# Altium schematic sheet [12]_MOT_tCONNECTOR.SchDoc
size A3; DocumentNumber: 12; SheetNumber: 12; SheetTotal: 12; Ngu?i ki?m tra: bangdd; Ngu?i thi?t k?: thannt114
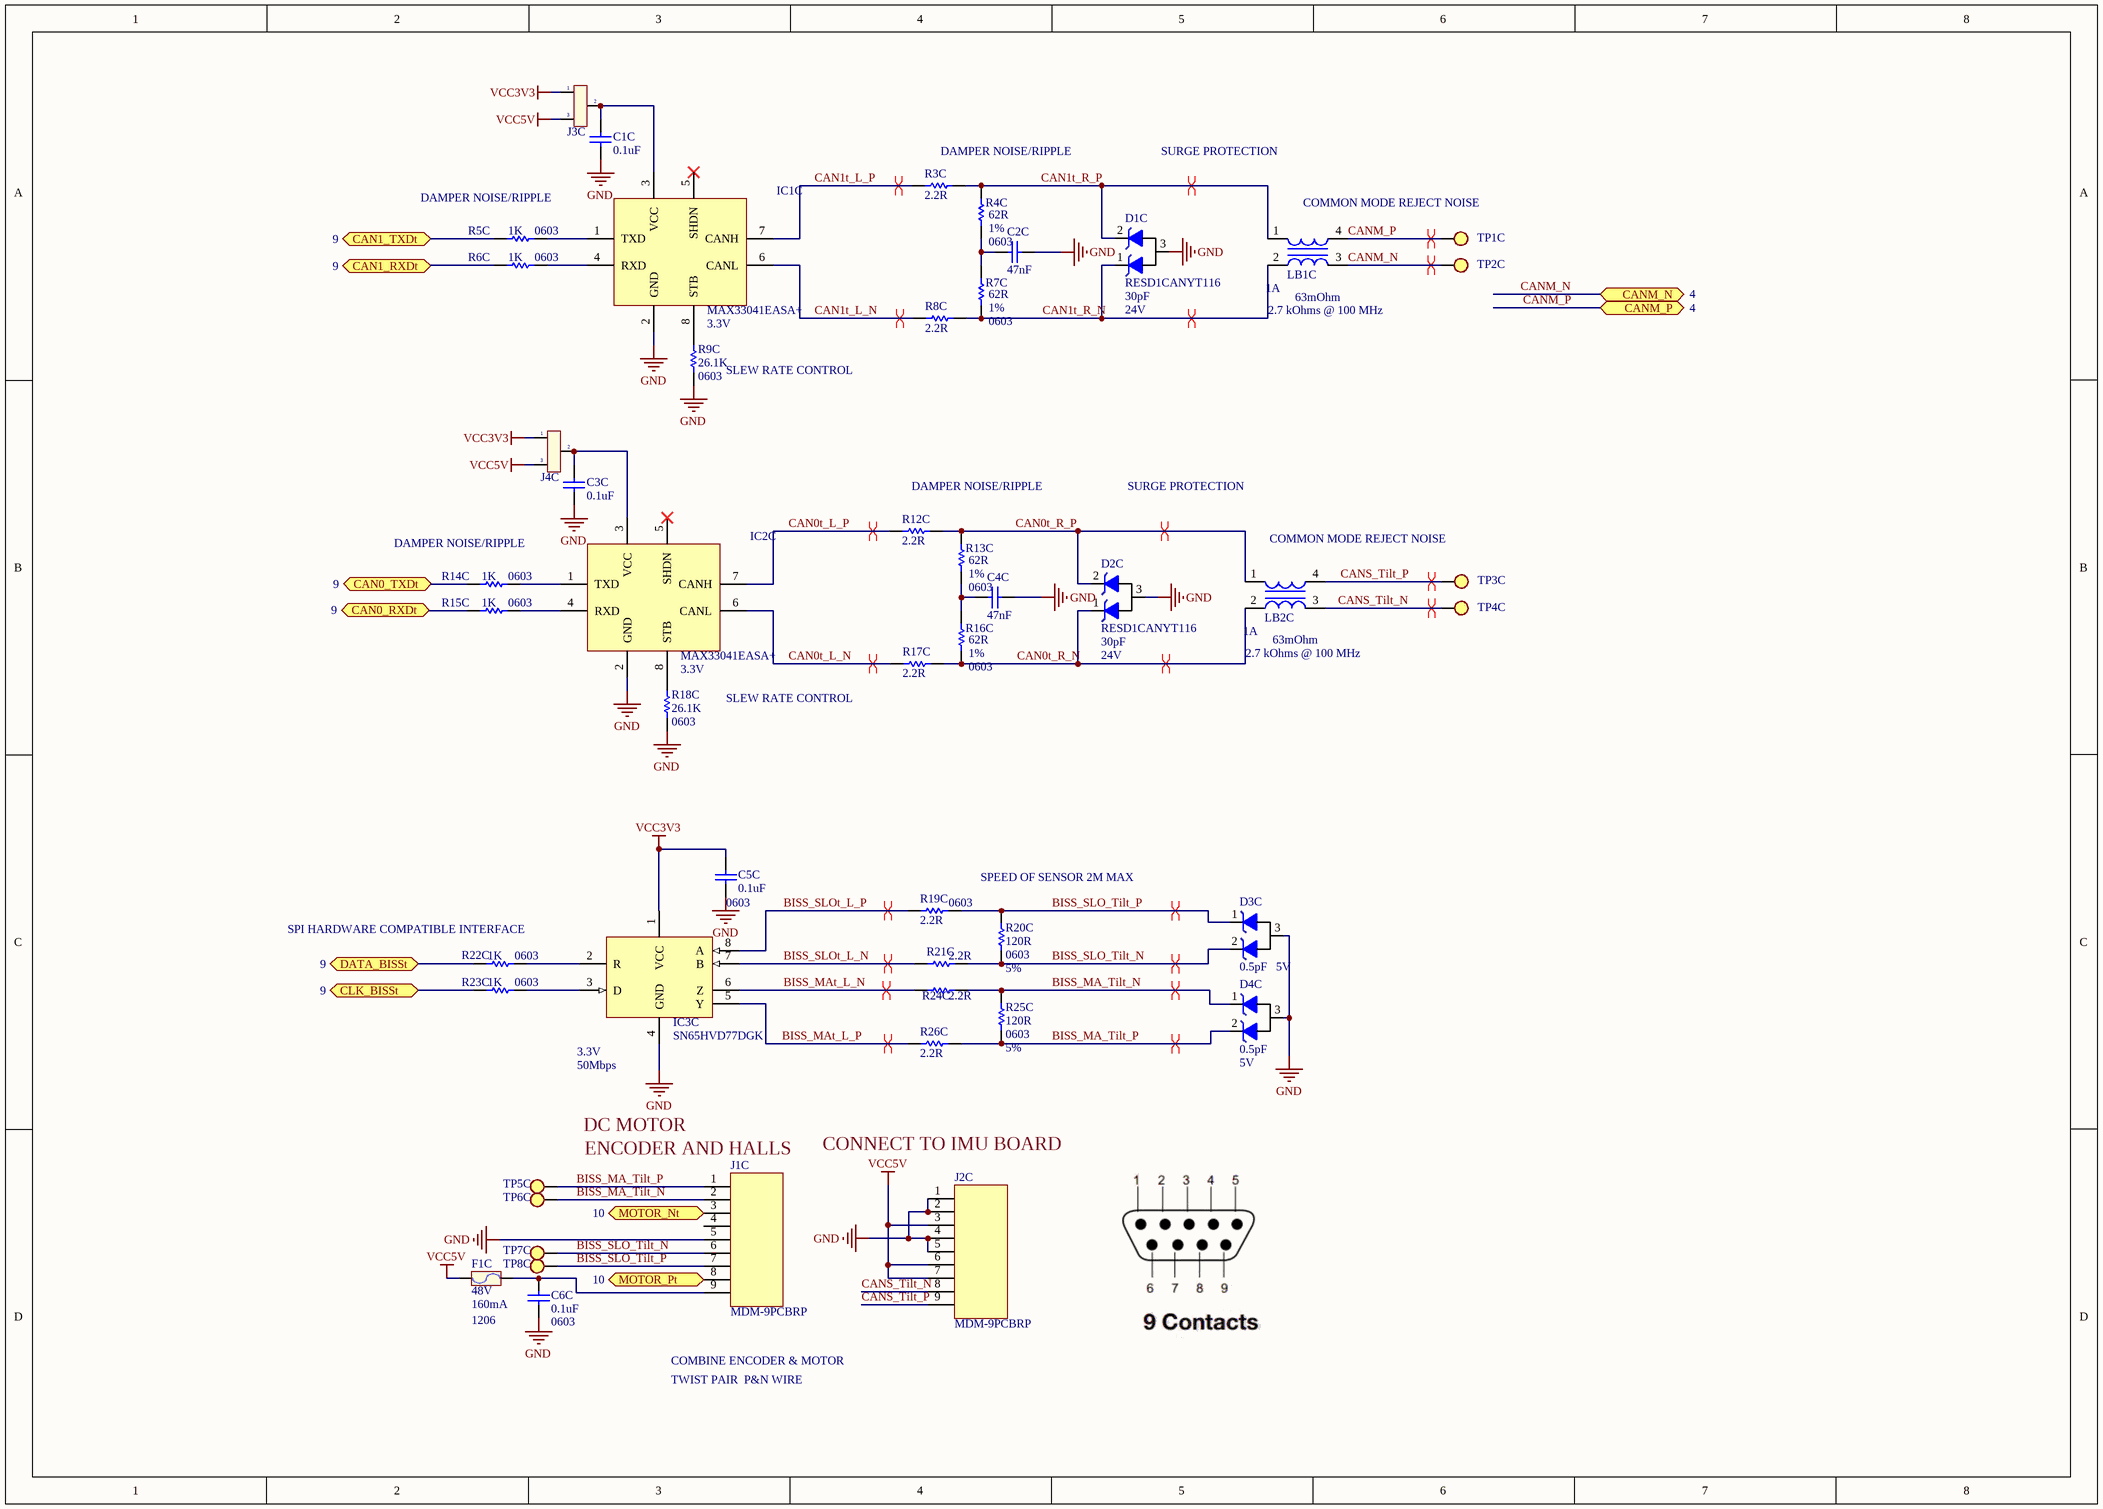
[diagram p0: [12]_MOT_tCONNECTOR.SchDoc]

## Parts
C1C  0.1uF  [CAP 0603]
C2C  47nF  [CAP 0603]
C3C  0.1uF  [CAP 0603]
C4C  47nF  [CAP 0603]
C5C  FOOTPRINT: 0603  [CAP 0603]  (hidden comment: 0.1uF)
C6C  FOOTPRINT: 0603  [CAP 0603]  (hidden comment: 0.1uF)
D1C  CAPACITANCE: 30pF  VOLTAGE: 24V  [SOT-23-3]  (hidden comment: RESD1CANYT116)
D2C  CAPACITANCE: 30pF  VOLTAGE: 24V  [SOT-23-3]  (hidden comment: RESD1CANYT116)
D3C  CAPACITANCE: 0.5pF  VOLTAGE: 5V  [SOT-416]  (hidden comment: ESDR0502BT1G)
D4C  CAPACITANCE: 0.5pF  VOLTAGE: 5V  [SOT-416]  (hidden comment: ESDR0502BT1G)
F1C  Voltage - Rated: 48V  Package / Case: 1206  Current Rating (Amps): 160mA  [RES 1206]  (hidden comment: 0ZCG0014FF2C)
IC1C  VOLTAGE: 3.3V  [8-SOIC]  (hidden comment: MAX33041EASA+)
IC2C  VOLTAGE: 3.3V  [8-SOIC]  (hidden comment: MAX33041EASA+)
IC3C  Manufacturer Part Number: SN65HVD77DGK  VOLTAGE: 3.3V  SPEED: 50Mbps  [8-VSSOP]  (hidden comment: IC;IC TRANSCEIVER FULL 1/1 8SOIC,8-SOIC,-40TO 85°C,SN65HVD77DR)
J1C  CONN-DIP;CONN MICRO-D PLUG 9POS R/A SLDR,M,MDM-9PCBRP  [MDM-9PCBRP]  (value not drawn)
J2C  CONN-DIP;CONN MICRO-D PLUG 9POS R/A SLDR,M,MDM-9PCBRP  [MDM-9PCBRP]  (value not drawn)
J3C  JP 2-1  [JP3]  (value not drawn)
J4C  JP 2-1  [JP3]  (value not drawn)
LB1C  CURRENT: 1A  IMPEDANCE: 2.7 kOhms @ 100 MHz  DCR: 63mOhm  [MCM-7060M]  (hidden comment: MCM-7060M-272-RU)
LB2C  CURRENT: 1A  IMPEDANCE: 2.7 kOhms @ 100 MHz  DCR: 63mOhm  [MCM-7060M]  (hidden comment: MCM-7060M-272-RU)
R3C  2.2R  [res 0603]
R4C  TOLERANCE: 1%  PACKAGE: 0603  [R0603]  (hidden comment: 62R)
R5C  PCB Footprint: 0603  [res 0603]  (hidden comment: 1K)
R6C  PCB Footprint: 0603  [res 0603]  (hidden comment: 1K)
R7C  TOLERANCE: 1%  PACKAGE: 0603  [R0603]  (hidden comment: 62R)
R8C  2.2R  [res 0603]
R9C  PCB Footprint: 0603  [R0603]  (hidden comment: 26.1K)
R12C  2.2R  [res 0603]
R13C  TOLERANCE: 1%  PACKAGE: 0603  [R0603]  (hidden comment: 62R)
R14C  PCB Footprint: 0603  [res 0603]  (hidden comment: 1K)
R15C  PCB Footprint: 0603  [res 0603]  (hidden comment: 1K)
R16C  TOLERANCE: 1%  PACKAGE: 0603  [R0603]  (hidden comment: 62R)
R17C  2.2R  [res 0603]
R18C  PCB Footprint: 0603  [R0603]  (hidden comment: 26.1K)
R19C  PCB Footprint: 0603  [res 0603]  (hidden comment: 2.2R)
R20C  PCB_ Footprint: 0603  Tolerance: 5%  [res 0603]  (hidden comment: 120R)
R21C  2.2R  [res 0603]
R22C  PCB Footprint: 0603  [res 0603]  (hidden comment: 1K)
R23C  PCB Footprint: 0603  [res 0603]  (hidden comment: 1K)
R24C  2.2R  [res 0603]
R25C  PCB_ Footprint: 0603  Tolerance: 5%  [res 0603]  (hidden comment: 120R)
R26C  2.2R  [res 0603]
TP1C  TP SMD  [TESTPOINT]  (value not drawn)  (no BOM)
TP2C  TP SMD  [TESTPOINT]  (value not drawn)  (no BOM)
TP3C  TP SMD  [TESTPOINT]  (value not drawn)  (no BOM)
TP4C  TP SMD  [TESTPOINT]  (value not drawn)  (no BOM)
TP5C  TP SMD  [TESTPOINT]  (value not drawn)  (no BOM)
TP6C  TP SMD  [TESTPOINT]  (value not drawn)  (no BOM)
TP7C  TP SMD  [TESTPOINT]  (value not drawn)  (no BOM)
TP8C  TP SMD  [TESTPOINT]  (value not drawn)  (no BOM)

## Ports
CAN0_RXDt (bidir, see 9), CAN0_TXDt (bidir, see 9), CAN1_RXDt (bidir, see 9), CAN1_TXDt (bidir, see 9), CANM_N (bidir, see 4), CANM_P (bidir, see 4), CLK_BISSt (bidir, see 9), DATA_BISSt (bidir, see 9), MOTOR_Nt (bidir, see 10), MOTOR_Pt (bidir, see 10)

## Nets
GND: C1C.2 C2C.2 C3C.2 C4C.2 C5C.2 C6C.2 D1C.3(A) D2C.3(A) D3C.3(A) D4C.3(A) IC1C.2(GND) IC2C.2(GND) IC3C.4(GND) J1C.5 J2C.1 J2C.2 J2C.4 J2C.5 R9C.2 R18C.2
VCC3V3: C5C.1 IC3C.1(VCC) J3C.1 J4C.1
VCC5V: F1C.2 J2C.3 J2C.6 J2C.7 J3C.3 J4C.3
BISS_MA_Tilt_N: D4C.1(K) J1C.2 R24C.1 R25C.1 TP6C.1
BISS_MA_Tilt_P: D4C.2(K) J1C.1 R25C.2 R26C.1 TP5C.1
BISS_MAt_L_N: IC3C.6(Z) R24C.2
BISS_MAt_L_P: IC3C.5(Y) R26C.2
BISS_SLO_Tilt_N: D3C.2(K) J1C.6 R20C.2 R21C.1 TP7C.1
BISS_SLO_Tilt_P: D3C.1(K) J1C.7 R19C.1 R20C.1 TP8C.1
BISS_SLOt_L_N: IC3C.7(B) R21C.2
BISS_SLOt_L_P: IC3C.8(A) R19C.2
CAN0_RXDt: R15C.2 ; port CAN0_RXDt
CAN0_TXDt: R14C.2 ; port CAN0_TXDt
CAN0t_L_N: IC2C.6(CANL) R17C.2
CAN0t_L_P: IC2C.7(CANH) R12C.2
CAN0t_R_N: D2C.1(K) LB2C.2 R16C.1 R17C.1
CAN0t_R_P: D2C.2(K) LB2C.1 R12C.1 R13C.2
CAN1_RXDt: R6C.2 ; port CAN1_RXDt
CAN1_TXDt: R5C.2 ; port CAN1_TXDt
CAN1t_L_N: IC1C.6(CANL) R8C.2
CAN1t_L_P: IC1C.7(CANH) R3C.2
CAN1t_R_N: D1C.1(K) LB1C.2 R7C.1 R8C.1
CAN1t_R_P: D1C.2(K) LB1C.1 R3C.1 R4C.2
CANM_N: LB1C.3 TP2C.1 ; port CANM_N
CANM_P: LB1C.4 TP1C.1 ; port CANM_P
CANS_Tilt_N: J2C.8 LB2C.3 TP4C.1
CANS_Tilt_P: J2C.9 LB2C.4 TP3C.1
CLK_BISSt: R23C.2 ; port CLK_BISSt
DATA_BISSt: R22C.2 ; port DATA_BISSt
MOTOR_Nt: J1C.3 ; port MOTOR_Nt
MOTOR_Pt: J1C.8 ; port MOTOR_Pt
NetC1C_1: C1C.1 IC1C.3(VCC) J3C.2
NetC2C_1: C2C.1 R4C.1 R7C.2
NetC3C_1: C3C.1 IC2C.3(VCC) J4C.2
NetC4C_1: C4C.1 R13C.1 R16C.2
NetC6C_1: C6C.1 F1C.1 J1C.9
NetIC1C_1: IC1C.1(TXD) R5C.1
NetIC1C_4: IC1C.4(RXD) R6C.1
NetIC1C_8: IC1C.8(STB) R9C.1
NetIC2C_1: IC2C.1(TXD) R14C.1
NetIC2C_4: IC2C.4(RXD) R15C.1
NetIC2C_8: IC2C.8(STB) R18C.1
NetIC3C_2: IC3C.2(R) R22C.1
NetIC3C_3: IC3C.3(D) R23C.1

Not connected (* = marked no-connect by the designer): IC1C 5(SHDN)*; IC2C 5(SHDN)*; J1C 4

## Layout directives
differential pair: BISS_MA_Tilt_N, BISS_MA_Tilt_P, BISS_MAt_L_N, BISS_MAt_L_P, BISS_SLO_Tilt_N, BISS_SLO_Tilt_P, BISS_SLOt_L_N, BISS_SLOt_L_P, CAN0t_L_N, CAN0t_L_P, CAN0t_R_N, CAN0t_R_P, CAN1t_L_N, CAN1t_L_P, CAN1t_R_N, CAN1t_R_P, CANM_N, CANM_P, CANS_Tilt_N, CANS_Tilt_P

## Notes on the sheet
- DAMPER NOISE/RIPPLE
- SURGE PROTECTION
- (near R5C) DAMPER NOISE/RIPPLE
- COMMON MODE REJECT NOISE
- (near R9C) SLEW RATE CONTROL
- (near R14C) DAMPER NOISE/RIPPLE
- SLEW RATE CONTROL
- SPEED OF SENSOR 2M MAX
- (near R22C) SPI HARDWARE COMPATIBLE INTERFACE
- DC MOTOR
- (near J1C) ENCODER AND HALLS
- (near J2C) CONNECT TO IMU BOARD
- COMBINE ENCODER & MOTOR
- TWIST PAIR  P&N WIRE

## Library data of the parts
C1C C3C = Cap: CAP-CER,SMD;0.1UF,10%,50V,X7R,0603; MANUFACTURER1: Samsung Electro-Mechanics; MANUFACTURER1_PART#: CL10B104KB8NNNC; MANUFACTURER2_PART#: M0603X104K050TAX; MANUFACTURER1: SS; Unit: PCS; PACKING: Tape & Reel (TR); PCB FOOTPRINT: 0603; Process Type: SM; CATEGORY: CAP-CER; VALUE: 0.1uF; FOOTPRINT: 0603; Material: X7R; Voltage: 50V; Tolerance: ±10%; MANUFACTURER2: UWA
C2C C4C = Cap: CAP-CER,SMD; 47nF,10%,50V,X7R,0603; MANUFACTURER1: Meritek; MANUFACTURER1_PART#: MA0603XR473K500; MANUFACTURER2_PART#: C0603X7R500-473KNE; Unit: PCS; PACKING: Tape & Reel (TR); PCB FOOTPRINT: 0603; Process Type: SM; CATEGORY: CAP-CER; VALUE: 47nF; FOOTPRINT: 0603; Material: X7R; Voltage: 50V; Tolerance: ±10%; MANUFACTURER2: Venkel
C5C C6C = Cap: CAP-CER,SMD;0.1UF,10%,50V,X7R,0603; MANUFACTURER1: Samsung Electro-Mechanics; MANUFACTURER1_PART#: CL10B104KB8NNNC; MANUFACTURER2_PART#: M0603X104K050TAX; MANUFACTURER1: SS; Unit: PCS; PACKING: Tape & Reel (TR); Process Type: SM; CATEGORY: CAP-CER; VALUE: 0.1uF; Material: X7R; Voltage: 50V; PCB FOOTPRINT: 0603; Tolerance: ±10%; MANUFACTURER2: UWA
D1C D2C = TVS_DUAL_SIGNAL_5V_SOT23: TVS DIODE 24VWM 50VC SOT23-; MANUFACTURER1: Littelfuse; CURRENT: 10A; POWER: 230W; Category: TVS; MANUFACTURER1_PART#: RESD1CANYT116; Value: RESD1CANYT116; LOH_CODE: *; LINK: https://www.digikey.com/en/products/detail/littelfuse-inc/SM24CANB-02HTG/5048174?s=N4IgTCBcDaIMoFkwBYDCBBAcgIQLQAYwAJAFQHEQBdAXyA; PRICE: 0.78000
D3C D4C = TVS_DUAL_SIGNAL_5V_SOT23: 5V, ESD PROTECTION DEVICES, SOT-23; MANUFACTURER2_PART#: DF3D6.8MS,LF; MANUFACTURER1: ON Semiconductor; CURRENT: 1A; POWER: 320W; Category: TVS; MANUFACTURER1_PART#: ESDR0502BT1G; MANUFACTURER2: Toshiba; Value: ESDR0502BT1G; LOH_CODE: *
F1C = 0875.800MXEP: PTC RESET FUSE 48V 160MA 1206; MANUFACTURER1_PART#: 0ZCJ0016FF2E; MANUFACTURER2_PART#: CLA1684; MANUFACTURER1: Bel Fuse; PROCESS_TYPE: SM; Unit: PCS; Response Time: 8ms; Breaking Capacity @ Rated Voltage: 10A; DC Cold Resistance: 1.1 Ohms; CATEGORY: FUSE; MANUFACTURER2: https://linhkienchatluong.vn/cau-chi-tu-phuc-hoi-ptc/cau-chi-tu-phuc-hoi-1206-01a-60v-ptc-smd_sp845_ct4084.aspx; Value: 0ZCG0014FF2C
IC1C IC2C = IC;IC CAN TRANSEIVER HS,8SOIC,-40TO150°C,TJA1042T/3,118: IC CAN TXRX 3.3V 2MBPS SOIC; MANUFACTURER1: Maxim; Manufacturer Part Number: MAX33041EASA+; VALUE: MAX33041EASA+; Category: IC; MANUFACTURER1_PART#: MAX33041EASA+; LINK: https://www.digikey.com/en/products/detail/maxim-integrated/MAX33041EASA/15286828; PRICE: 3.5700
IC3C = IC;IC TRANSCEIVER FULL 1/1 8SOIC,8-SOIC,-40TO 85°C,SN65HVD77DR: IC TRANSCEIVER FULL 1/1 8VSSOP; Manufacturer: TI; MANUFACTURER1: Texas Instruments; VALUE: SN65HVD77DGK; Category: IC; LINK: https://www.digikey.com/en/products/detail/texas-instruments/SN65HVD77DR/4965743; PRICE: 3.623; MANUFACTURER1_PART#: SN65HVD77DGK
J1C J2C = CONN-DIP;CONN MICRO-D PLUG 9POS R/A SLDR,M,MDM-9PCBRP: CONN MICRO-D PLUG 9POS R/A SLDR; Manufacturer: ITT CANNON, LLC; Manufacturer Part Number: MDM-9PCBRP; MANUFACTURER1: ITT CANNON, LLC; MANUFACTURER1_PART#: MDM-9PCBRP
  J1C: Category: CONN
  J2C: CATEGORY: CONN
J3C J4C = JP 2-1: Jumper 2-1; Value: J2-1
LB1C LB2C = CHOKE-SMD;90OHM@100MHz,0.15A,5V,DLP11SA900HL2L: CMC 1A 2LN 2.7KOHM SMD; MANUFACTURER1: Mag Layers; VALUE: MCM-7060M-272-RU; LINK: https://www.digikey.com/en/products/detail/mag-layers/MCM-7060M-272-RU/13910475; MANUFACTURER1_PART#: MCM-7060M-272-RU; NI_MARK: *; MANUFACTURER2_PART#: *; MANUFACTURER2: *; Category: CHOKE; PRICE: 0.60000; PACKAGE: (7.50mm x 6.00mm)
R3C R8C R12C R17C R21C R24C R26C = Res0.3: RES SMD 2.2 OHM 5% 1/10W 0603; MANUFACTURER1: Yageo; MANUFACTURER1_PART#: RC0603JR-072R2L; MANUFACTURER2_PART#: RMCF0603JT2R20; PACKING: Tape & Reel (TR); PCB Footprint: 0603; Process Type: SM; Unit: PCS; Power: 0.25W; Value: 2.2R; CATEGORY: RES-SMD; MANUFACTURER2: Stackpole Electronics Inc; Tolerance: ±5%
R4C R7C R13C R16C = RES-SMD;60.4OHM,1%,0402,1/10W: RES SM 62 OHM 1% 1/10W 0603; MANUFACTURER1: Stackpole; MANUFACTURER1_PART#: RMCF0603FT62R0; MANUFACTURER2_PART#: RC0603FR-0762RL; VALUE: 62R; Category: RES-SMD; MANUFACTURER2: YAGEO
R5C R6C R14C R15C R22C R23C = Res0.3: RES SMD,1K OHM,5%,1/10W,0603; MANUFACTURER1: Stackpole Electronics Inc; MANUFACTURER1_PART#: RMCF06031K00JNEAC; MANUFACTURER2_PART#: R0603J1KTG; DESCCRIPTION: RES SMD 1K OHM 5% 1/10W 0603; PACKING: Tape & Reel (TR); Process Type: SM; Unit: PCS; LOH_Code: 140100083; Power: 0.25W; Value: 1K; CATEGORY: RES SMD; MANUFACTURER2: UWA; Tolerance: ±5%
R9C R18C = Res0.3: RES 26.1K OHM 1% 1/10W 0603; MANUFACTURER1: Stackpole Electronics Inc; MANUFACTURER1_PART#: RMCF0603FT26K1; MANUFACTURER2_PART#: RC0603FR-0726K1L; PACKING: Tape & Reel (TR); Process Type: SM; Unit: PCS; Power: 0.25W; Value: 26.1K; CATEGORY: RES-SMD; MANUFACTURER2: YAGEO; Tolerance: ±1%
R19C = Res0.3: RES SMD 2.2 OHM 5% 1/10W 0603; MANUFACTURER1: Yageo; MANUFACTURER1_PART#: RC0603JR-072R2L; MANUFACTURER2_PART#: RMCF0603JT2R20; PACKING: Tape & Reel (TR); Process Type: SM; Unit: PCS; Power: 0.25W; Value: 2.2R; CATEGORY: RES-SMD; MANUFACTURER2: Stackpole Electronics Inc; Tolerance: ±5%
R20C R25C = RES 120 OHM 5% 1/10W 0603: MANUFACTURER1: Stackpole; MANUFACTURER1_PART#: RMCF0603JG120R; PROC: SM; Unit: PCS; CATEGORY: RES-SMD; VALUE: 120R; FOOTPRINT: 0603
TP1C TP2C TP3C TP4C TP5C TP6C TP7C TP8C = TP SMD: TEST POINT